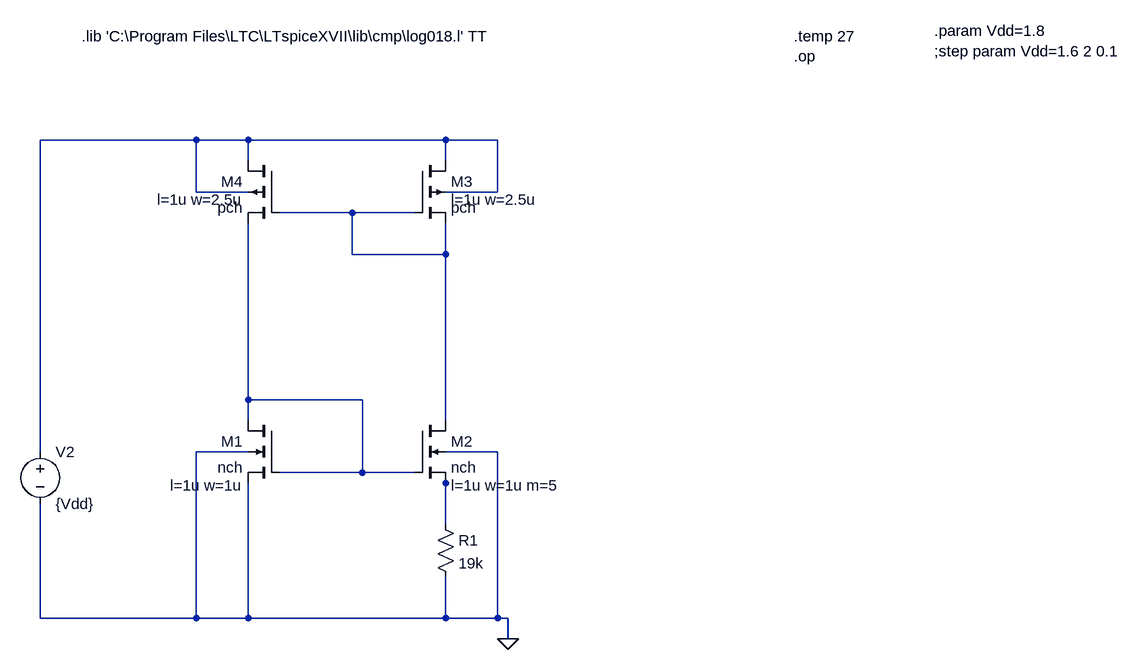
[diagram p0: schematic E5_constant_gm_NMOS.asc]
E5_constant_gm_NMOS.asc, the LTspice schematic file:
Version 4
SHEET 1 1892 784
WIRE -304 -80 -544 -80
WIRE -224 -80 -304 -80
WIRE 80 -80 -224 -80
WIRE 160 -80 80 -80
WIRE -224 -48 -224 -80
WIRE 80 -48 80 -80
WIRE -304 0 -304 -80
WIRE -224 0 -304 0
WIRE 160 0 160 -80
WIRE 160 0 80 0
WIRE -64 32 -176 32
WIRE 32 32 -64 32
WIRE -64 96 -64 32
WIRE 80 96 80 48
WIRE 80 96 -64 96
WIRE -224 320 -224 48
WIRE -48 320 -224 320
WIRE -224 352 -224 320
WIRE 80 352 80 96
WIRE -544 400 -544 -80
WIRE -224 400 -304 400
WIRE 160 400 80 400
WIRE -48 432 -48 320
WIRE -48 432 -176 432
WIRE 32 432 -48 432
WIRE 80 448 80 432
WIRE 80 512 80 448
WIRE -544 656 -544 480
WIRE -304 656 -304 400
WIRE -304 656 -544 656
WIRE -224 656 -224 448
WIRE -224 656 -304 656
WIRE 80 656 80 592
WIRE 80 656 -224 656
WIRE 160 656 160 400
WIRE 160 656 80 656
WIRE 176 656 160 656
WIRE 176 688 176 656
FLAG 176 688 0
DATAFLAG -176 320 ""
DATAFLAG -416 -80 ""
DATAFLAG -416 -80 ""
DATAFLAG 80 208 "Id(M2)"
DATAFLAG -224 192 "Id(M1)"
DATAFLAG -16 96 ""
SYMBOL voltage -544 384 R0
WINDOW 123 0 0 Left 0
WINDOW 39 0 0 Left 0
SYMATTR InstName V2
SYMATTR Value {Vdd}
SYMBOL nmos4 32 352 R0
WINDOW 123 56 100 Left 2
SYMATTR Value2 l=1u w=1u m=5
SYMATTR InstName M2
SYMATTR Value nch
SYMBOL nmos4 -176 352 M0
WINDOW 123 56 100 Left 2
SYMATTR Value2 l=1u w=1u
SYMATTR InstName M1
SYMATTR Value nch
SYMBOL pmos4 32 -48 R0
WINDOW 123 56 60 Left 2
SYMATTR Value2 l=1u w=2.5u
SYMATTR InstName M3
SYMATTR Value pch
SYMBOL pmos4 -176 -48 M0
WINDOW 123 56 60 Left 2
SYMATTR Value2 l=1u w=2.5u
SYMATTR InstName M4
SYMATTR Value pch
SYMBOL res 64 496 R0
SYMATTR InstName R1
SYMATTR Value 19k
TEXT -480 -240 Left 2 !.lib 'C:\\Program Files\\LTC\\LTspiceXVII\\lib\\cmp\\log018.l' TT
TEXT 832 -248 Left 2 !.param Vdd=1.8\n;step param Vdd=1.6 2 0.1
TEXT 616 -240 Left 2 !.temp 27\n.op

The netlist it stands for:
* E5_constant_gm_NMOS.asc
V2 N001 0 {Vdd}
M2 N002 N003 N004 0 nch l=1u w=1u m=5
M1 N003 N003 0 0 nch l=1u w=1u
M3 N001 N002 N002 N001 pch l=1u w=2.5u
M4 N001 N002 N003 N001 pch l=1u w=2.5u
R1 N004 0 19k
.model NMOS NMOS
.model PMOS PMOS
.lib standard.mos
.lib 'C:\Program Files\LTC\LTspiceXVII\lib\cmp\log018.l' TT
.param Vdd=1.8
;step param Vdd=1.6 2 0.1
.temp 27
.op
.backanno
.end